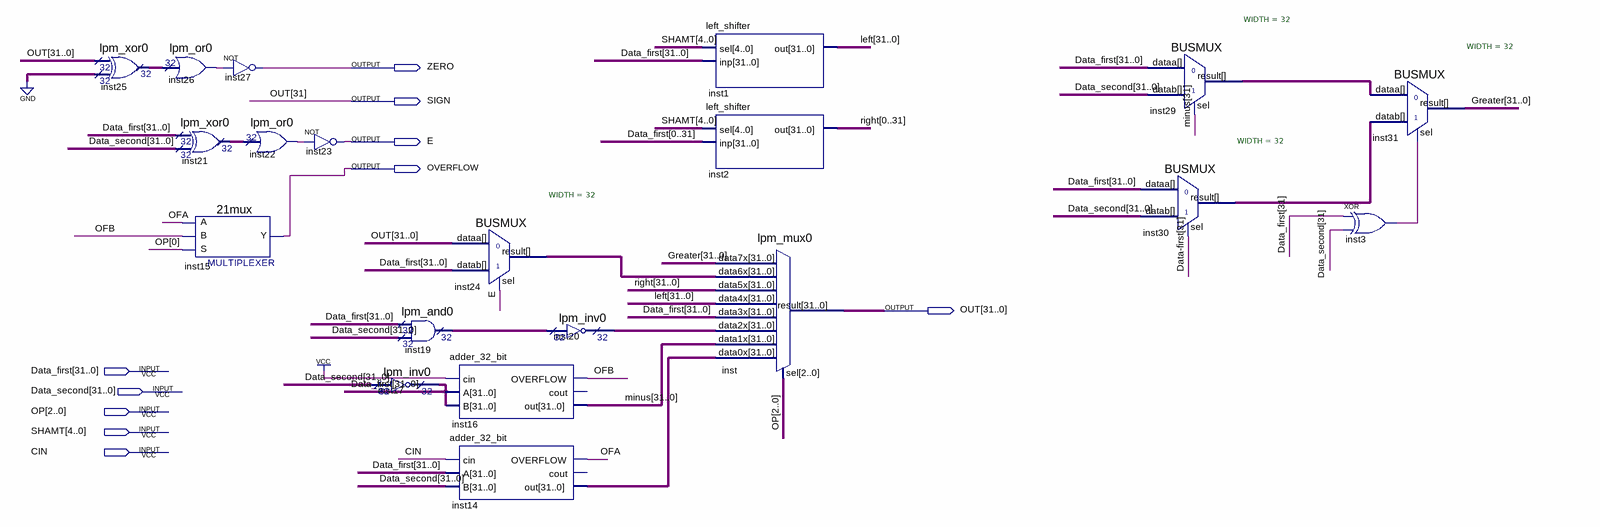
[diagram p0: schematic sheet]
// Quartus schematic ALU.bdf as structural Verilog: 20 symbols, 10 pins
module ALU (
  input  [31:0] Data_first,
  input  [31:0] Data_second,
  input  [2:0] OP,
  input  [4:0] SHAMT,
  input  CIN,
  output ZERO,
  output SIGN,
  output E,
  output OVERFLOW,
  output [31:0] OUT
);

  wire inst3_out, inst22_result, inst26_result, OFA, OFB;
  wire [31:0] Greater, inst14_out, inst19_result, inst20_result, inst21_result, inst24_result, inst25_result,
       inst29_result, inst30_result, left, minus, right;
  wire [31:31] \Data-first ;

  lpm_xor0 inst25 (.data0x(OUT), .data1x({32{1'b0}}), .result(inst25_result));
  lpm_or0 inst26 (.data(inst25_result), .result(inst26_result));
  not inst27 (ZERO, inst26_result);
  lpm_xor0 inst21 (.data0x(Data_first), .data1x(Data_second), .result(inst21_result));
  \21mux  inst15 (.S(OP[0]), .B(OFB), .A(OFA), .Y(OVERFLOW));
  lpm_or0 inst22 (.data(inst21_result), .result(inst22_result));
  not inst23 (E, inst22_result);
  lpm_inv0 inst17 (.data(Data_second), .result(Data_first));
  lpm_and0 inst19 (.data0x(Data_first), .data1x(Data_second), .result(inst19_result));
  BUSMUX #(.WIDTH(32)) inst24 (.datab(Data_first), .sel(E), .dataa(OUT), .result(inst24_result));
  adder_32_bit inst16 (.cin(1'b1), .A(Data_first), .B(Data_first), .OVERFLOW(OFB), .out(minus));  // open: cout
  adder_32_bit inst14 (.cin(CIN), .A(Data_first), .B(Data_second), .OVERFLOW(OFA), .out(inst14_out));  // open: cout
  lpm_inv0 inst20 (.data(inst19_result), .result(inst20_result));
  left_shifter inst1 (.sel(SHAMT), .inp(Data_first), .out(left));
  left_shifter inst2 (
    .sel(SHAMT),
    .inp({Data_first[0], Data_first[1], Data_first[2], Data_first[3], Data_first[4], Data_first[5], Data_first[6], Data_first[7], Data_first[8], Data_first[9], Data_first[10], Data_first[11], Data_first[12], Data_first[13], Data_first[14], Data_first[15], Data_first[16], Data_first[17], Data_first[18], Data_first[19], Data_first[20], Data_first[21], Data_first[22], Data_first[23], Data_first[24], Data_first[25], Data_first[26], Data_first[27], Data_first[28], Data_first[29], Data_first[30], Data_first[31]}),
    .out({right[0], right[1], right[2], right[3], right[4], right[5], right[6], right[7], right[8], right[9], right[10], right[11], right[12], right[13], right[14], right[15], right[16], right[17], right[18], right[19], right[20], right[21], right[22], right[23], right[24], right[25], right[26], right[27], right[28], right[29], right[30], right[31]}));
  lpm_mux0 inst (
    .data7x(Greater), .data6x(inst24_result), .data5x(right), .data4x(left), .data3x(Data_first),
    .data2x(inst20_result), .data1x(minus), .data0x(inst14_out), .sel(OP), .result(OUT));
  BUSMUX #(.WIDTH(32)) inst30 (.datab(Data_second), .sel(\Data-first [31]), .dataa(Data_first), .result(inst30_result));
  BUSMUX #(.WIDTH(32)) inst29 (.datab(Data_second), .sel(minus[31]), .dataa(Data_first), .result(inst29_result));
  xor inst3 (inst3_out, Data_first[31], Data_second[31]);
  BUSMUX #(.WIDTH(32)) inst31 (.datab(inst30_result), .sel(inst3_out), .dataa(inst29_result), .result(Greater));

  assign SIGN = OUT[31];
endmodule
